# EAGLE design rpi-display-5110-0 (EAGLE 7.7.0)
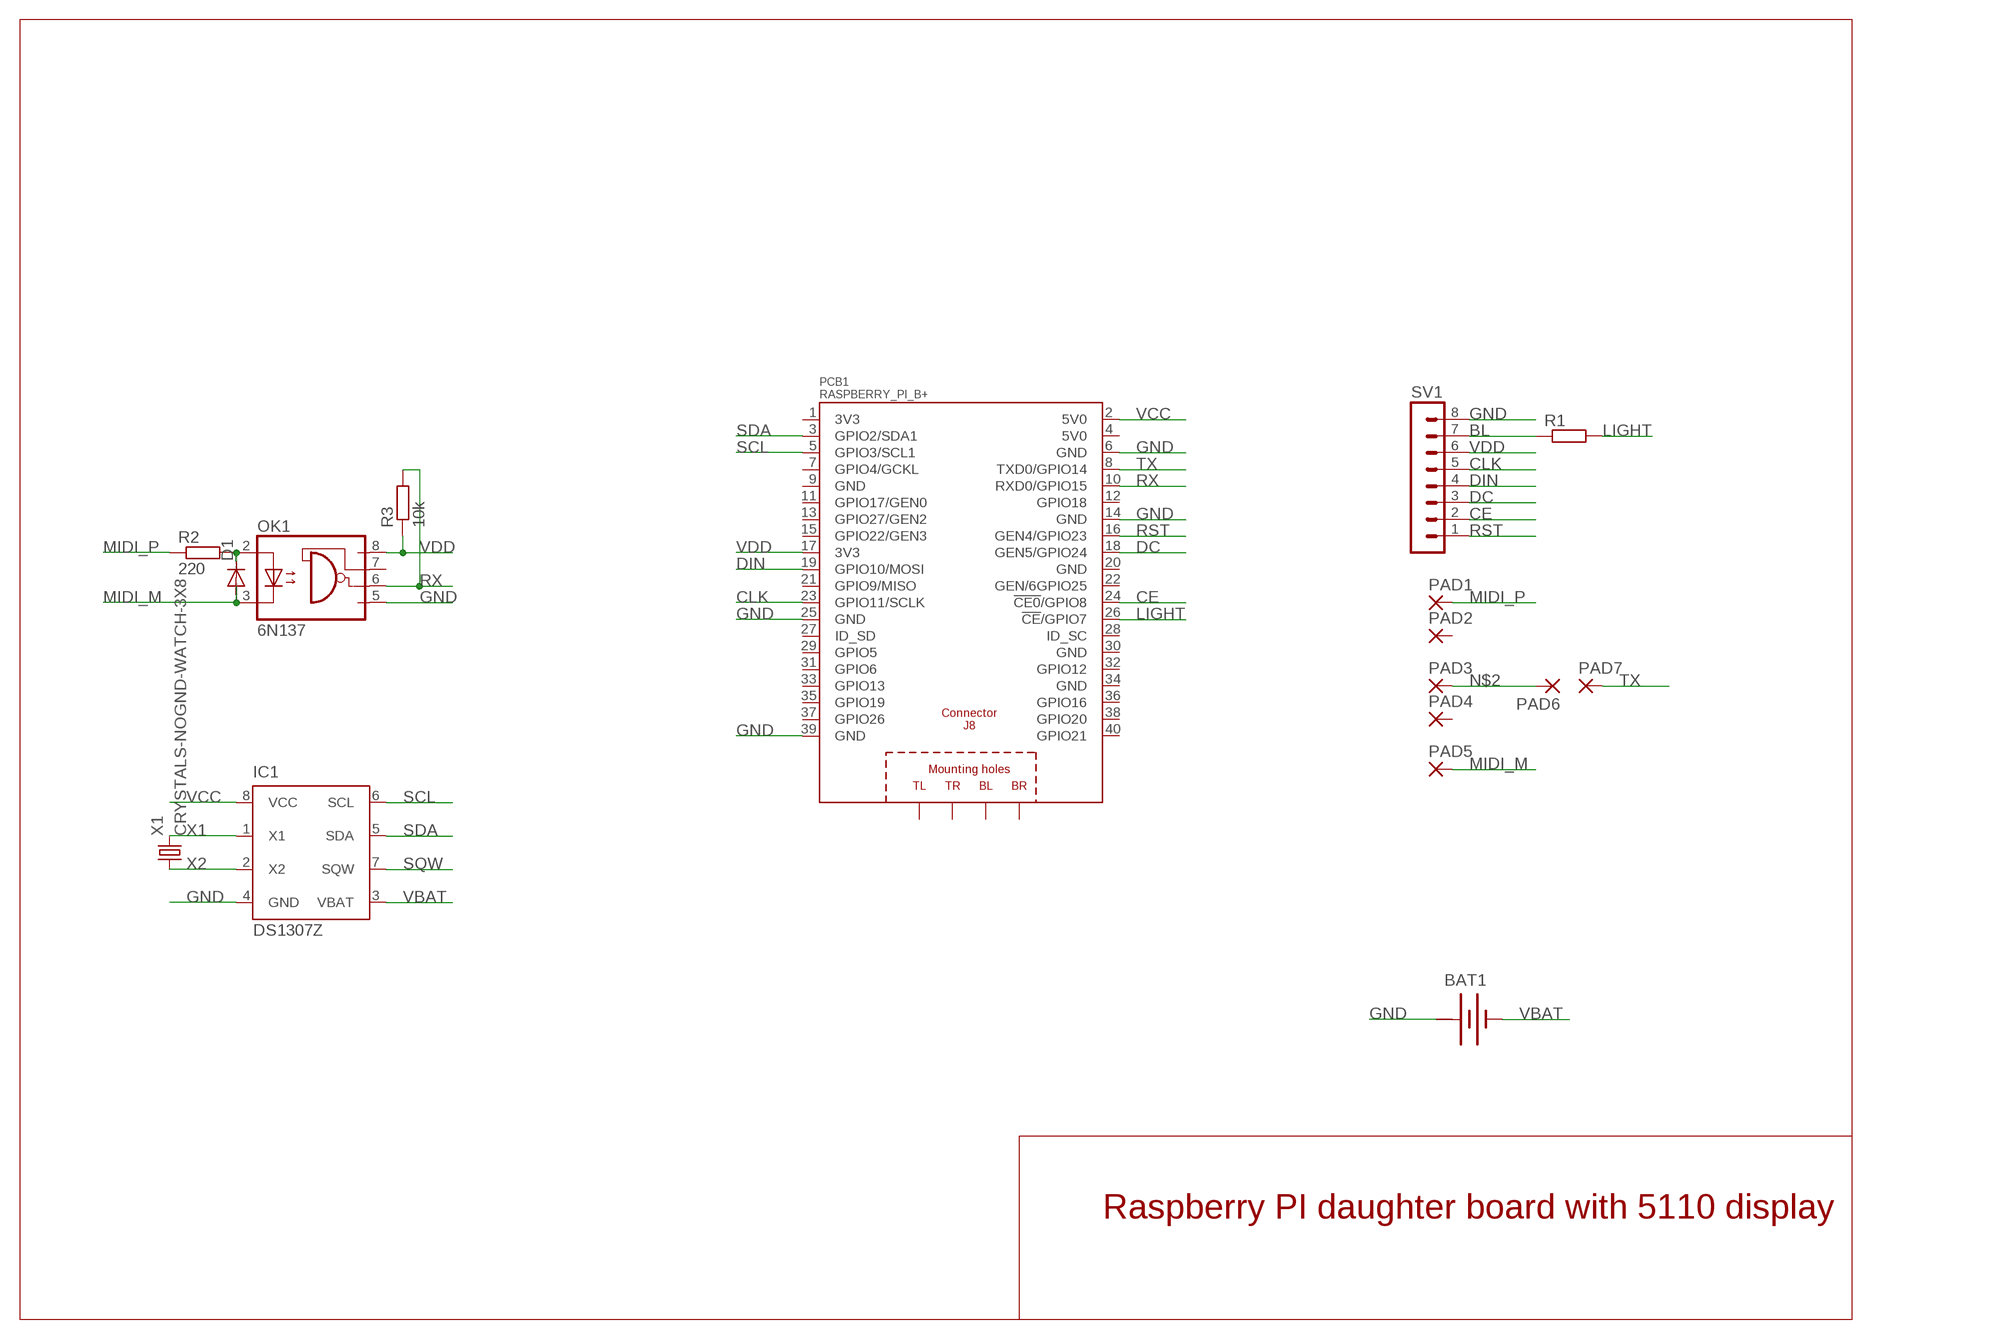
[diagram p0: schematic, sheet 1]

## Parts
BAT1  BATTERY  [BATTERY]
D1  DIODE-MINIMELF  [MINIMELF]
IC1  DS1307Z  [SOIC8]
OK1  6N137  [DIL08]
PAD1  1,6/0,8  [1,6/0,8]
PAD2  1,6/0,8  [1,6/0,8]
PAD3  1,6/0,8  [1,6/0,8]
PAD4  1,6/0,8  [1,6/0,8]
PAD5  1,6/0,8  [1,6/0,8]
PAD6  1,6/0,8  [1,6/0,8]
PAD7  1,6/0,8  [1,6/0,8]
PCB1  RASPBERRY_PI_B+  [RASPBERRY_PI_B+]
R1  R-EU_R0805  [R0805]
R2  220  R-EU_R0805  [R0805]
R3  10k  R-EU_R0805  [R0805]
SV1  MA08-1  [MA08-1]
X1  CRYSTALS-NOGND-WATCH-3X8  [WATCH-3X8]

## Nets
BL: R1.1 SV1.7
CE: PCB1.24(!CE0!/GPIO8) SV1.2
CLK: PCB1.23(GPIO11/SCLK) SV1.5
DC: PCB1.18(GEN5/GPIO24) SV1.3
DIN: PCB1.19(GPIO10/MOSI) SV1.4
GND: BAT1.+ IC1.4(GND) OK1.5(GND) PCB1.6(GND) PCB1.14(GND) PCB1.25(GND) PCB1.39(GND) SV1.8
LIGHT: PCB1.26(!CE!/GPIO7) R1.2
MIDI_M: OK1.3(C) PAD5.1(P)
MIDI_P: PAD1.1(P) R2.1
N$1: D1.C OK1.2(A) R2.2
N$2: PAD3.1(P) PAD6.1(P)
RST: PCB1.16(GEN4/GPIO23) SV1.1
RX: OK1.6(VO) PCB1.10(RXD0/GPIO15) R3.2
SCL: IC1.6(SCL) PCB1.5(GPIO3/SCL1)
SDA: IC1.5(SDA) PCB1.3(GPIO2/SDA1)
SQW: IC1.7(SQW)
TX: PAD7.1(P) PCB1.8(TXD0/GPIO14)
VBAT: BAT1.- IC1.3(VBAT)
VCC: IC1.8(VCC) PCB1.2(5V0)
VDD: OK1.8(VCC) PCB1.17(3V3) R3.1 SV1.6
X1: IC1.1(X1) X1.2
X2: IC1.2(X2) X1.1
Unconnected: D1.A OK1.7(VE) PAD2.1(P) PAD4.1(P) PCB1.1(3V3) PCB1.4(5V0) PCB1.7(GPIO4/GCKL) PCB1.9(GND) PCB1.11(GPIO17/GEN0) PCB1.12(GPIO18) PCB1.13(GPIO27/GEN2) PCB1.15(GPIO22/GEN3) PCB1.20(GND) PCB1.21(GPIO9/MISO) PCB1.22(GEN/6GPIO25) PCB1.27(ID_SD) PCB1.28(ID_SC) PCB1.29(GPIO5) PCB1.30(GND) PCB1.31(GPIO6) PCB1.32(GPIO12) PCB1.33(GPIO13) PCB1.34(GND) PCB1.35(GPIO19) PCB1.36(GPIO16) PCB1.37(GPIO26) PCB1.38(GPIO20) PCB1.40(GPIO21) PCB1.PE_BL(BL) PCB1.PE_BR(BR) PCB1.PE_TL(TL) PCB1.PE_TR(TR)

## Notes on the sheet
- Raspberry PI daughter board with 5110 display

## Power pins joined to a net without a drawn wire
+: BAT1.+@1(+)

## Library data of the parts
BAT1 = special:BATTERY: BATTERY
D1 = diode:DIODE-: DIODE
IC1 = ds1307_pcf8583:DS1307: I2C-Bus CLOCK/CALENDAR
OK1 = optocoupler:6N137: MOTOROLA OPTO COUPLER; MPN: 6N137; OC_FARNELL: 1328376; OC_NEWARK: 52M1895
PAD1-PAD7 = wirepad:1,6/0,8: THROUGH-HOLE PAD
PCB1 = RASPBERRY_PI_Bplus:RASPBERRY_PI_B+: Raspberry Pi B+ Based on issue: Thursday, July 10, 2014 - Rev 1.2 LBR by Tim R. 07-2014
R1-R3 = rcl:R-EU_: RESISTOR, European symbol
SV1 = con-lstb:MA08-1: PIN HEADER; OC_FARNELL: unknown; OC_NEWARK: unknown
X1 = IQD-Frequency-Products:CRYSTALS-NOGND: CRYSTALS CAN NOT GROUNDED

## Board
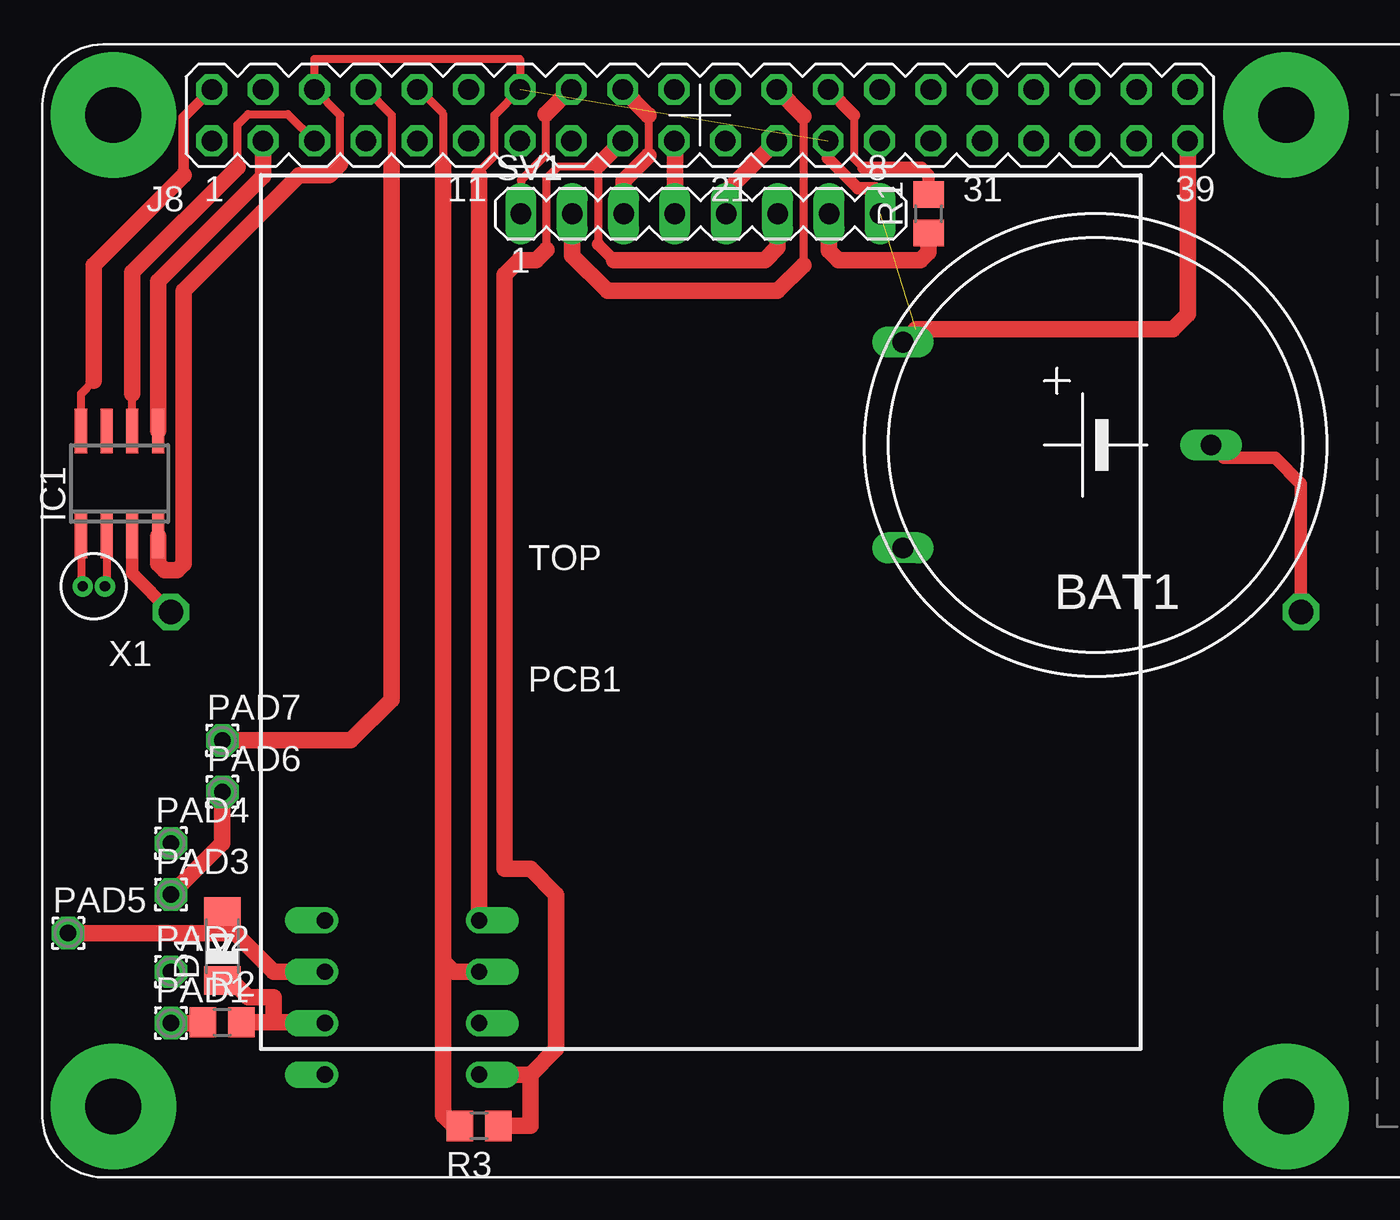
[diagram p1: board, top side]
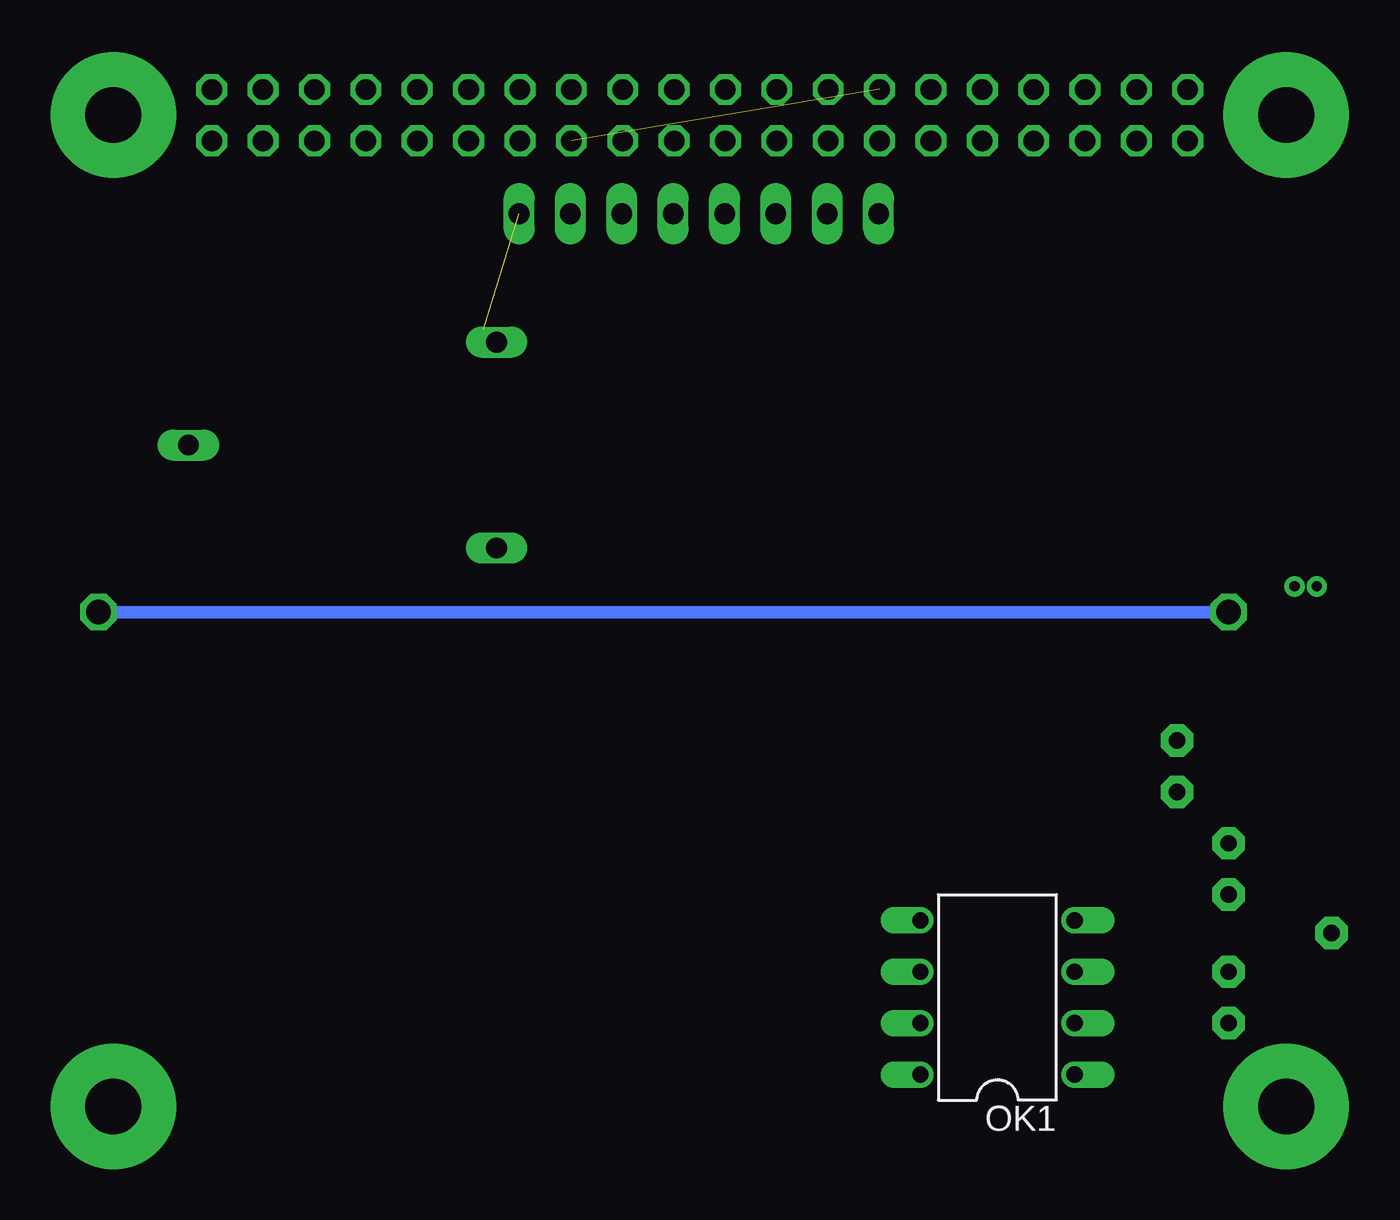
[diagram p2: board, bottom side, seen from below]

No outline drawn. Coordinates in mm, seen from the top.
Copper layers (1*16): Top 0.035mm / dielectric 1.5mm / Bottom 0.035mm
Design rules "default": minimum track width 10mil, minimum drill 24mil, track to track 8mil, track to pad 8mil, pad to pad 8mil, via to via 8mil, smd to smd 8mil, copper to edge 40mil, drill to drill 8mil, minimum pad ring 10mil, minimum via ring 8mil, stop-mask expansion 4mil, vias tented up to drill 0mil, thermal gap 10mil

### Footprints (pad centres in the part's own frame; a part is rotated, then mirrored left to right if it is on the bottom)
BATTERY = drill 1.016 long: + 9.525,-5.08; +@1 9.525,5.08; - -5.715,0
MINIMELF = smd 1.4 x 1.8: A 1.7,0; C -1.7,0
SOIC8 = smd 0.6 x 2.2: 1 -1.905,-2.6; 2 -0.635,-2.6; 3 0.635,-2.6; 4 1.905,-2.6; 5 1.905,2.6; 6 0.635,2.6; 7 -0.635,2.6; 8 -1.905,2.6
DIL08 = drill 0.813 offset: 1 -3.81,-3.81; 2 -1.27,-3.81; 3 1.27,-3.81; 4 3.81,-3.81; 5 3.81,3.81; 6 1.27,3.81; 7 -1.27,3.81; 8 -3.81,3.81
1,6/0,8 = drill 0.813 pad 1.6 octagon: 1 0,0
RASPBERRY_PI_B+ = drill 1.016 octagon: 1 8.37,51.23; 2 8.37,53.77; 3 10.91,51.23; 4 10.91,53.77; 5 13.45,51.23; 6 13.45,53.77; 7 15.99,51.23; 8 15.99,53.77; 9 18.53,51.23; 10 18.53,53.77; 11 21.07,51.23; 12 21.07,53.77; 13 23.61,51.23; 14 23.61,53.77; 15 26.15,51.23; 16 26.15,53.77; 17 28.69,51.23; 18 28.69,53.77; 19 31.23,51.23; 20 31.23,53.77; 21 33.77,51.23; 22 33.77,53.77; 23 36.31,51.23; 24 36.31,53.77; 25 38.85,51.23; 26 38.85,53.77; 27 41.39,51.23; 28 41.39,53.77; 29 43.93,51.23; 30 43.93,53.77; 31 46.47,51.23; 32 46.47,53.77; 33 49.01,51.23; 34 49.01,53.77; 35 51.55,51.23; 36 51.55,53.77; 37 54.09,51.23; 38 54.09,53.77; 39 56.63,51.23; 40 56.63,53.77 | drill 2.75 pad 6.2: PE_BL 3.5,3.5; PE_BR 61.5,3.5; PE_TL 3.5,52.5; PE_TR 61.5,52.5
R0805 = smd 1.3 x 1.5: 1 -0.95,0; 2 0.95,0
MA08-1 = drill 1.016 long: 1 -8.89,0; 2 -6.35,0; 3 -3.81,0; 4 -1.27,0; 5 1.27,0; 6 3.81,0; 7 6.35,0; 8 8.89,0
WATCH-3X8 = drill 0.5 pad 0.9: 1 -0.55,0; 2 0.55,0

### Placement (x,y rotation side)
BAT1  52.07,36.2 180 top
D1  8.89,11.43 90 top
IC1  3.81,34.29 0 top
OK1  17.78,8.89 90 bottom
PAD1  6.35,7.62 0 top
PAD2  6.35,10.16 0 top
PAD3  6.35,13.97 0 top
PAD4  6.35,16.51 0 top
PAD5  1.27,12.06 0 top
PAD6  8.89,19.05 0 top
PAD7  8.89,21.59 0 top
PCB1  0,0 0 top
R1  43.81,47.62 90 top
R2  8.89,7.66 0 top
R3  21.59,2.54 180 top
SV1  32.54,47.62 0 top
X1  2.54,29.21 180 top

### Tracks (layer width: path | path; a pad name or v marks a point on that pad's centre or on a via)
BL
  Top 0.813: SV1.7 38.89,45.8 39.37,45.32 43.42,45.32 43.81,45.72 R1.1
CE
  Top 0.406: 37.62,52.46 37.62,45.09
  Top 0.813: PCB1.24 37.62,52.46 | 37.62,45.09 36.35,43.81 27.94,43.81 26.19,45.56 SV1.2
CLK
  Top 0.813: PCB1.23 33.81,48.73 SV1.5
DC
  Top 0.406: 29.96,52.51 29.96,50.48
  Top 0.813: PCB1.18 29.95,52.51 29.96,52.51 | 29.96,50.48 28.73,49.25 SV1.3
DIN
  Top 0.813: PCB1.19 31.27,51.19 SV1.4
GND  (2 unrouted)
  Top 0.406: 21.59,49.53 21.59,49.73 22.34,50.48 22.34,52.5 PCB1.14 23.61,55.28 13.45,55.28 PCB1.6 14.72,52.5 14.72,50.09
  Top 0.61: PCB1.25 38.85,50.37 40.32,48.9 41.19,48.9 41.43,48.65
  Top 0.813: 41.43,48.65 SV1.8 | OK1.5 21.59,49.53 | IC1.4 5.71,30.32 6.03,30 6.67,30 6.99,30.32 6.99,43.81 12.7,49.53 14.17,49.53 14.72,50.09 | PCB1.39 56.63,42.66 55.88,41.91 43.18,41.91 BAT1.+
LIGHT
  Top 0.406: 40.12,52.51 40.12,50.36 40.6,49.89
  Top 0.61: PCB1.26 40.12,52.51 | 40.6,49.89 43.46,49.89 43.81,49.53 R1.2
MIDI_M
  Top 0.813: PAD5.1 9.53,12.06 11.43,10.16 OK1.3
MIDI_P
  Top 0.813: PAD1.1 7.9,7.62 R2.1
N$1
  Top 0.813: R2.2 11.43,7.66 | 11.43,7.66 13.93,7.66 OK1.2 | D1.C 9.32,9.73 10.16,8.89 11.43,8.89 11.43,7.66
N$2
  Top 0.813: PAD3.1 8.89,16.51 PAD6.1
RST
  Top 0.406: 24.88,52.55 24.88,50.52 23.65,49.29 SV1.1
  Top 0.813: PCB1.16 26.11,53.77 24.88,52.55
RX
  Top 0.406: PCB1.10 18.62,53.77 19.8,52.59 19.8,50.01
  Top 0.813: 19.8,50.01 19.8,10.68 | 19.8,10.68 20.32,10.16 OK1.6 | 19.8,10.68 19.8,3.06 20.32,2.54 R3.2
SCL
  Top 0.406: IC1.6 4.45,38.73 | 9.64,49.93 9.64,52.03 10.16,52.55 12.13,52.55 PCB1.5
  Top 0.813: 4.45,38.73 4.45,44.73 9.64,49.93
SDA
  Top 0.813: IC1.5 5.71,44.29 10.91,49.49 PCB1.3
TX
  Top 0.406: PCB1.8 16,53.77 17.26,52.51 17.26,50.01
  Top 0.813: 17.26,50.01 17.26,23.61 15.24,21.59 PAD7.1
VBAT  (via drill 1.2)
  Top 0.61: IC1.3 4.45,29.84 v6.35,27.94 | v62.23,27.94 62.23,34.29 60.96,35.56 58.42,35.56 BAT1.-
  Bottom 0.61: v6.35,27.94 v62.23,27.94
VCC
  Top 0.406: IC1.8 1.91,38.73 2.54,39.37
  Top 0.508: 6.99,49.53 6.99,52.38 PCB1.2
  Top 0.813: 2.54,39.37 2.54,45.09 6.99,49.53
VDD
  Top 0.406: 27.5,50.05 27.46,50.01 | 27.46,50.01 27.46,46.12 | 24.92,45.84 24.92,49.37 25.52,49.97 27.42,49.97 27.46,50.01
  Top 0.61: 27.46,46.12 28.26,45.32
  Top 0.813: PCB1.17 27.51,50.05 27.5,50.05 | 28.26,45.32 35.72,45.32 36.35,45.96 SV1.6 | OK1.8 24.13,5.08 | 24.13,5.08 25.4,6.35 25.4,13.97 24.13,15.24 22.86,15.24 22.86,44.61 23.57,45.32 24.41,45.32 24.92,45.84 | R3.1 24.13,2.54 24.13,5.08
X1
  Top 0.406: IC1.1 1.91,29.3 X1.2
X2
  Top 0.406: IC1.2 3.17,29.3 X1.1